# Altium project PCB_Siren.PrjPcb
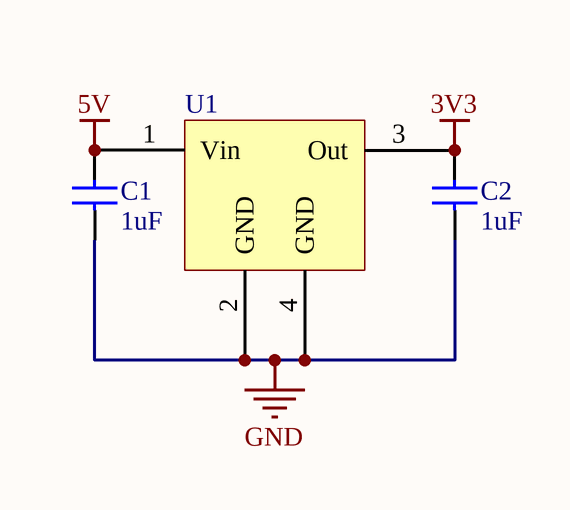
[diagram p0: 5Vto3V3_Power_Connector.SchDoc]
1 sheet, 3 parts. Net scope: global (net labels, ports and power ports of the same name join across sheets).
Board file: Siren.PcbDoc

## Sheet 5Vto3V3_Power_Connector.SchDoc
size A

### Parts
C1  value 1uF  [CAPC0603]  (hidden comment: Cap)
C2  value 1uF  [CAPC0603]  (hidden comment: Cap)
U1  3.3V LDO Reg  [SOT23-4n]  (value not drawn)

### Nets
3V3: C2.1(A) U1.3(Out)
5V: C1.1(A) U1.1(Vin)
GND: C1.2(B) C2.2(B) U1.2(GND) U1.4(GND)

### Library data of the parts
U1 = LM3940IMPX-3.3: IC REG LDO 3.3V 1A SOT223; Supplier 1: Digi-Key; Supplier Part Number 1: LM3940IMPX-3.3/NOPBCT-ND
C1 C2 = Cap: Supplier 1: Digi-Key; Supplier Part Number 1: 1276-1000-1-ND